# Altium schematic sheet ST_LINK_V2-1.SCHDOC: ST-LINK/V2-1 with support of SWD only
size A4; Date: 29-OCT-2015; Author: A.B; CompanyName: STMicroelectronics; Organization: MCD/TOOLS/GNB; Address1: 12, Rue Jules HOROWITZ; Address2: 38019 Grenoble; Address3: FRANCE; DocumentNumber: MB1225; Revision: B-01; SheetNumber: 3; SheetTotal: 13; Project: STM32F769I-DISCO
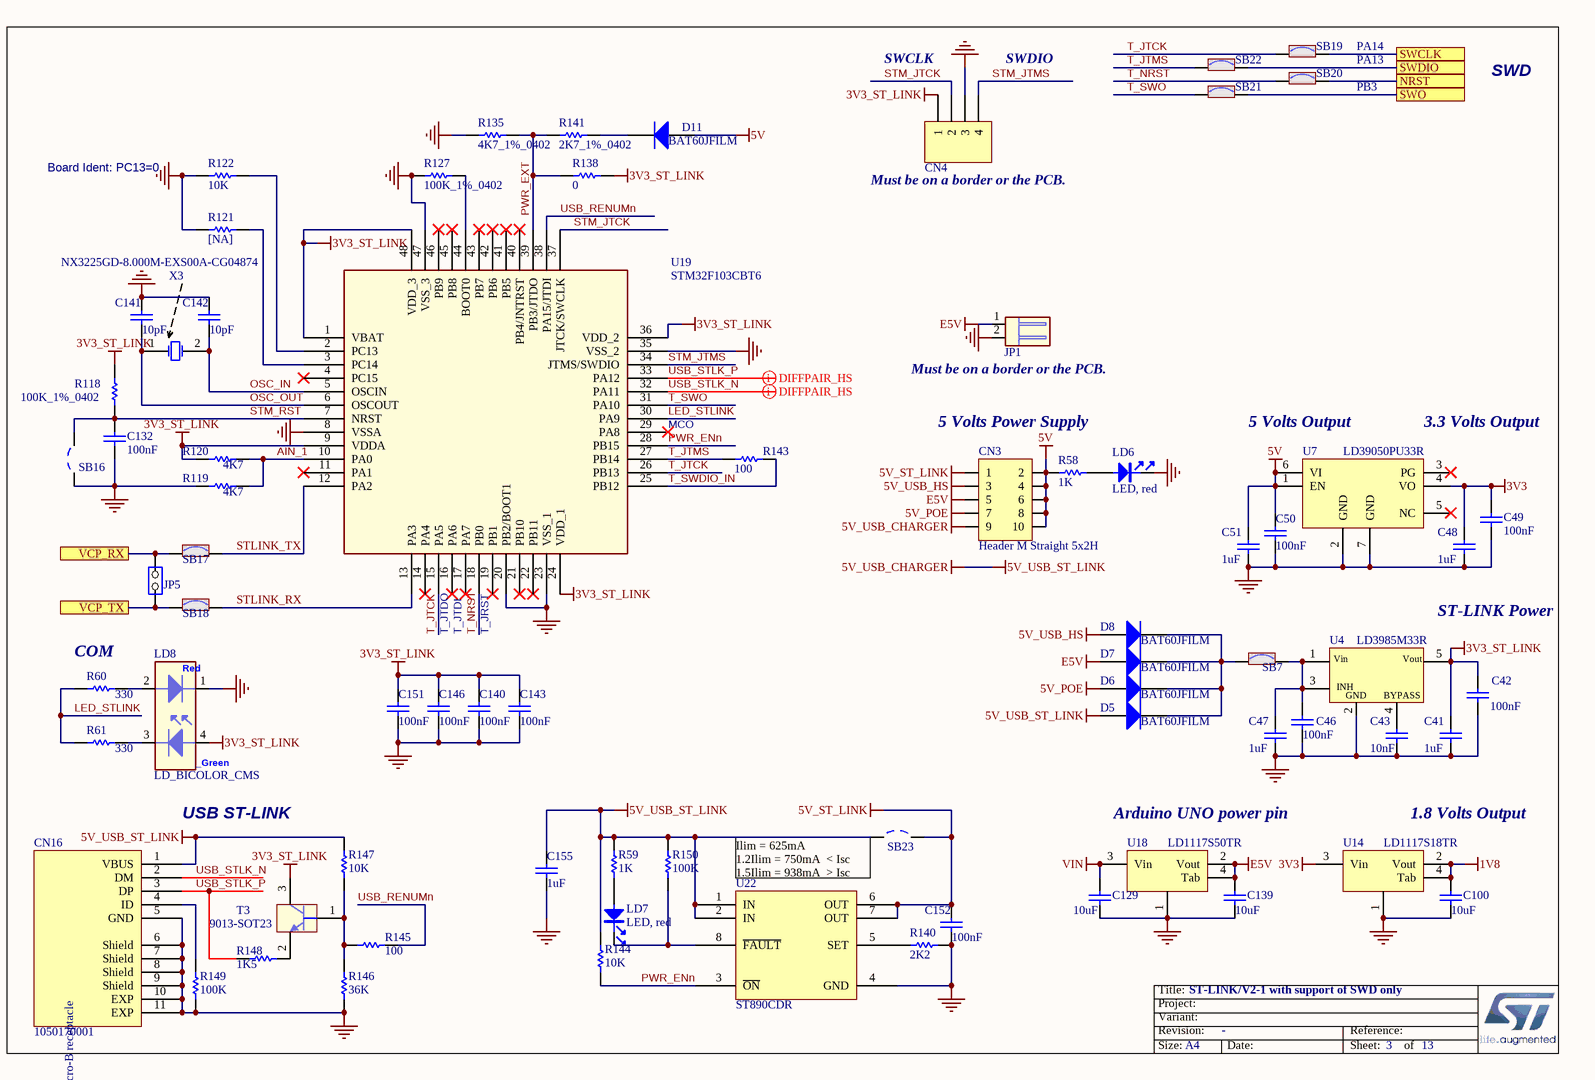
[diagram p0: ST_LINK_V2-1.SCHDOC]

## Parts
C41  1uF  [0603C]
C42  100nF  [0402C]
C43  10nF  [0603C]
C46  100nF  [0402C]
C47  1uF  [0603C]
C48  1uF  [0603C]
C49  100nF  [0402C]
C50  100nF  [0402C]
C51  1uF  [0603C]
C100  10uF  [0603C]
C129  10uF  [0805C]
C132  100nF  [0402C]
C139  10uF  [0805C]
C140  100nF  [0402C]
C141  10pF  [0402C]
C142  10pF  [0402C]
C143  100nF  [0402C]
C146  100nF  [0402C]
C151  100nF  [0402C]
C152  100nF  [0402C]
C155  1uF  [0603C]
CN3  Header M Straight 5x2H  [HDR_2X5_2R54]
CN4  Header 4  [HDR_1X4_2R54]  (value not drawn)
CN16  1050170001  [MICRO_USB_B_105017]
D5  BAT60JFILM  [SOD-323]
D6  BAT60JFILM  [SOD-323]
D7  BAT60JFILM  [SOD-323]
D8  BAT60JFILM  [SOD-323]
D11  BAT60JFILM  [SOD-323]
JP1  WF25402-06421  [HDR_1X2_2R54_RA_11R35]  (value not drawn)
JP5  JP2  [SIP2]  (value not drawn)
LD6  LED, red  [0603D]
LD7  LED, red  [0603D]
LD8  LD_BICOLOR_CMS  [LED2_3528]
R58  1K  [0402R]
R59  1K  [0402R]
R60  330  [0402R]
R61  330  [0402R]
R118  100K_1%_0402  [0402R]
R119  4K7  [0402R]
R120  4K7  [0402R]
R121  [NA]  [0402R]
R122  10K  [0402R]
R127  100K_1%_0402  [0402R]
R135  4K7_1%_0402  [0402R]
R138  0  [0402R]
R140  2K2  [0402R]
R141  2K7_1%_0402  [0402R]
R143  100  [0402R]
R144  10K  [0402R]
R145  100  [0402R]
R146  36K  [0402R]
R147  10K  [0402R]
R148  1K5  [0402R]
R149  100K  [0402R]
R150  100K  [0402R]
SB7  Solder Bridge ON  [JP2_SMD]  (value not drawn)
SB16  Solder Bridge OFF  [JP2_SMD]  (value not drawn)
SB17  Solder Bridge ON  [JP2_SMD]  (value not drawn)
SB18  Solder Bridge ON  [JP2_SMD]  (value not drawn)
SB19  Solder Bridge ON  [JP2_SMD]  (value not drawn)
SB20  Solder Bridge ON  [JP2_SMD]  (value not drawn)
SB21  Solder Bridge ON  [JP2_SMD]  (value not drawn)
SB22  Solder Bridge ON  [JP2_SMD]  (value not drawn)
SB23  Solder Bridge OFF  [JP2_SMD]  (value not drawn)
T3  9013-SOT23  [SOT-23]
U4  LD3985M33R  [SOT-23-5L]
U7  LD39050PU33R  [DFN6_0R95_3X3]
U14  LD1117S18TR  [SOT-223]
U18  LD1117S50TR  [SOT-223]
U19  STM32F103CBT6  [LQFP48_0R5_9X9]
U22  ST890CDR  [SOIC8_1R27_4R9X6]
X3  NX3225GD-8.000M-EXS00A-CG04874  [XTAL_2SM_3R2X2R5_H1]

## Ports
NRST, SWCLK, SWDIO, SWO, VCP_RX, VCP_TX

## Nets
1V8: C100.2 U14.2(Vout) U14.4(Tab)
3V3: C48.2 C49.2 U7.4(VO) U14.3(Vin)
3V3_ST_LINK: C41.1 C42.2 C140.1 C143.2 C146.2 C151.2 CN4.1 LD8.4 R118.2 R120.1 R138.2 T3.3(C) U4.5(Vout) U19.1(VBAT) U19.9(VDDA) U19.24(VDD_1) U19.36(VDD_2) U19.48(VDD_3)
5V: C50.2 C51.2 CN3.2 CN3.4 CN3.6 CN3.8 CN3.10 D11.1(A) R58.1 U7.1(EN) U7.6(VI)
5V_POE: CN3.7 D6.1(A)
5V_ST_LINK: C152.2 CN3.1 SB23.2 U22.6(OUT) U22.7(OUT)
5V_USB_CHARGER: C155.2 CN3.9 CN16.1(VBUS) D5.1(A) R59.2 R144.2 R147.2 R150.2 SB23.1 U22.1(IN) U22.2(IN)  [also labelled 5V_USB_ST_LINK]
5V_USB_HS: CN3.3 D8.1(A)
E5V: C139.2 CN3.5 D7.1(A) JP1.1 U18.2(Vout) U18.4(Tab)
GND: C41.2 C42.1 C43.1 C46.1 C47.1 C48.1 C49.1 C50.1 C51.1 C100.1 C129.1 C132.1 C139.1 C140.2 C141.1 C142.1 C143.1 C146.1 C151.1 C152.1 C155.1 CN4.3 CN16.5(GND) CN16.6(Shield) CN16.7(Shield) CN16.8(Shield) CN16.9(Shield) CN16.10(EXP) CN16.11(EXP) JP1.2 LD6.2 LD8.1 R119.1 R121.1 R122.1 R127.1 R135.1 R140.2 R146.1 R149.1 SB16.1 U4.2(GND) U7.2(GND) U7.7(GND) U14.1 U18.1 U19.8(VSSA) U19.20(PB2/BOOT1) U19.23(VSS_1) U19.35(VSS_2) U19.47(VSS_3) U22.4(GND)
VIN: C129.2 U18.3(Vin)
AIN_1: R119.2 R120.2 U19.10(PA0)
LED_STLINK: R60.1 R61.1 U19.30(PA9)
NRST: SB20.2 ; port NRST
OSC_IN: C142.2 U19.5(OSCIN) X3.2(OSC2)
OSC_OUT: C141.2 U19.6(OSCOUT) X3.1(OSC1)
PWR_ENn: R144.1 U19.28(PB15) U22.3(~{ON})
PWR_EXT: R135.2 R138.1 R141.1 U19.39(PB3/JTDO)
STLINK_RX: SB18.2 U19.13(PA3)
STLINK_TX: SB17.2 U19.12(PA2)
STM_JTCK: CN4.2 U19.37(JTCK/SWCLK)
STM_JTMS: CN4.4 U19.34(JTMS/SWDIO)
STM_RST: C132.2 R118.1 SB16.2 U19.7(NRST)
SWCLK: SB19.2 ; port SWCLK
SWDIO: SB22.2 ; port SWDIO
SWO: SB21.2 ; port SWO
T_JTCK: SB19.1 U19.15(PA5) U19.26(PB13)
T_JTMS: R143.1 SB22.1 U19.27(PB14)
T_NRST: SB20.1 U19.18(PB0)
T_SWDIO_IN: R143.2 U19.25(PB12)
T_SWO: SB21.1 U19.31(PA10)
USB_RENUMn: R145.2 U19.38(PA15/JTDI)
USB_STLK_N: CN16.2(DM) U19.32(PA11)
USB_STLK_P: CN16.3(DP) R148.1 U19.33(PA12)
VCP_RX: JP5.2(NO) SB17.1 ; port VCP_RX
VCP_TX: JP5.1(COMMON) SB18.1 ; port VCP_TX
NetC43_2: C43.2 U4.4(BYPASS)
NetC46_2: C46.2 C47.2 SB7.2 U4.1(Vin) U4.3(CE)
NetCN16_4: CN16.4(ID) R149.2
NetD5_2: D5.2(K) D6.2(K) D7.2(K) D8.2(K) SB7.1
NetD11_2: D11.2(K) R141.2
NetLD6_1: LD6.1 R58.2
NetLD7_1: LD7.1 R59.1
NetLD7_2: LD7.2 R150.1 U22.8(~{FAULT})
NetLD8_2: LD8.2 R60.2
NetLD8_3: LD8.3 R61.2
NetR121_2: R121.2 U19.3(PC14)
NetR122_2: R122.2 U19.2(PC13)
NetR127_2: R127.2 U19.44(BOOT0)
NetR140_1: R140.1 U22.5(SET)
NetR145_1: R145.1 R146.2 R147.1 T3.1(B)
NetR148_2: R148.2 T3.2(E)

Not connected (* = marked no-connect by the designer): U7 3(PG)* 5(NC)*; U19 4(PC15)* 11(PA1)* 14(PA4)* 16(PA6)* 17(PA7)* 19(PB1)* 21(PB10)* 22(PB11)* 29(PA8)* 40(PB4/JNTRST)* 41(PB5)* 42(PB6)* 43(PB7)* 45(PB8)* 46(PB9)*

## Layout directives
differential pair: USB_STLK_N, USB_STLK_P

## Notes on the sheet
- SWCLK
- SWDIO
- PA14
- PA13
- PB3
- SWD
- Board Ident: PC13=0
- (near CN4) Must be on a border or the PCB.
- (near JP1) Must be on a border or the PCB.
- MCO
- 5 Volts Power Supply
- (near U7) 5 Volts Output
- (near U7) 3.3 Volts Output
- (near R60) COM
- T_JTDO
- T_JTDI
- T_JRST
- ST-LINK Power
- USB ST-LINK
- (near SB23) Ilim = 625mA
  1.2Ilim = 750mA  < Isc
  1.5Ilim = 938mA  > Isc
- Arduino UNO power pin
- 1.8 Volts Output
- Title:
- Project:
- Size:
- Revision:
- Variant:
- A4
- -
- Date:
- Reference:
- Sheet:
- of
- (in symbol 1050170001) USB_Micro-B receptacle
- (in symbol LD3985M33R) INH
- (in symbol LD_BICOLOR_CMS) Red; _Green

## Library data of the parts
C41 C47 C48 C51 C155 = Cap_1uF_X5R_10%_0603: Capacitor,1uF,16V,X5R,10%,0603,YAGEO; Manuf_Part_1: CC0603KRX5R7BB105; Revision: July-2002: Re-released for DXP Platform.; Value: 1uF; Order: CC0603KRX5R7BB105; Manuf_1: YAGEO
  C155: ECCN_US/EU: n/a
C42 C46 C49 C50 C132 C140 C143 C146 C151 C152 = Cap_100nF_X7R_10%_0402: Capacitor,100nF,16V,X7R,10%,0402,YAGEO; Manuf_Part_1: CC0402KRX7R7BB104; Revision: July-2002: Re-released for DXP Platform.; Value: 100nF; Order: CC0402KRX7R7BB104; Manuf_1: YAGEO
C43 = Cap_10nF_X7R_10%_0603: Capacitor,10nF,50V,X7R,10%,0603,YAGEO; Manuf_Part_1: CC0603KRX7R9BB103; Revision: July-2002: Re-released for DXP Platform.; Value: 10nF; Order: CC0603KRX7R9BB103; Manuf_1: YAGEO
C100 = Cap_10uF_X5R_10%_0603: Capacitor,10uF,6.3V,X5R,10%,0603,YAGEO; Manuf_Part_1: CC0603KRX5R5BB106; Revision: July-2002: Re-released for DXP Platform.; Value: 10uF; Order: CC0603KRX5R5BB106; Manuf_1: YAGEO; ECCN_US/EU: n/a
C129 C139 = Cap_10uF_X5R_10%_0805: Capacitor,10uF,25V,X5R,10%,0805,YAGEO; Manuf_Part_1: CC0805KRX5R8BB106; Revision: July-2002: Re-released for DXP Platform.; Value: 10uF; Order: CC0805KRX5R8BB106; Manuf_1: YAGEO; ECCN_US/EU: n/a
C141 C142 = Cap_10pF_NPO_5%_0402: Capacitor,10pF,50V,NPO,5%,0402,YAGEO; Order: CC0402JRNPO9BN100; Revision: July-2002: Re-released for DXP Platform.; Value: 10pF; Manuf_1: YAGEO; Manuf_Part_1: CC0402JRNPO9BN100; ECCN_US/EU: n/a
CN3 = Header 5X2M: Header Male, 5-Pin, Dual row, Straight, AMD; Manuf_Part_1: 826632-5; Manuf_1: AMD; Distrib: Sub Co; Footprint: HDR2X5H; ECCN_US/EU: n/a; SOFER_FP: HDR_2X5_2R54
CN4 = Header 4: Header, 4-Pin; Fitted: NO; Revision: 17-Jul-2002: Re-released for DXP Platform.; Publisher: Altium Limited; ECCN_US/EU: n/a; SOFER_FP: HDR_1X4_2R54
CN16 = 1050170001: USB-MICRO-B, 1050170001, SMT, MOLEX; ECCN_US/EU: n/a; Manuf_1: MOLEX; Manuf_Part_1: 1050170001; Distrib: DIGIKEY; SOFER_FP: MICRO_USB_B_105017
D5-D8 D11 = BAT60JFILM: Manuf_1: STM; Provided: ST; ECCN_US/EU: EAR99/NEC; Ref St: 9151097; Revision: July-2002: Re-released for DXP Platform.; Order: BAT60JFILM; Manuf_Part_1: BAT60JFILM; Distrib: ST
JP1 = JP2_RA: Header, 2-Pins, Single row, Right Angle, 2.54 mm pitch, DIP; Manuf_1: ATOM; ECCN_US/EU: n/a; Manuf_Part_1: WF25402-06421; Distrib: Sub Co
JP5 = JP2: Fitted: NO; ECCN_US/EU: n/a
LD6 LD7 = LED_red: LED, red, 0603; Manuf_1: everlight; Manuf_Part_1: 19-213-R6C-AP1Q2B/3T; ECCN_US/EU: EAR99/NEC; Order: 19-213-R6C-AP1Q2B/3T
LD8 = LD_BICOLOR_CMS: Bicolor Led; Manuf_Part_1: HSMF-A201-A00J1; Manuf_1: Avago Technologies; Manuf_2: everluck; Manuf_Part_2: LE-RGW35280; Ref St: xxxxxx; ECCN_US/EU: EAR99/NEC; Distrib: RADIOSPARES; Footprint: HSMF-A201
R58 R59 = Res_1K_1%_0402: Resistor,1K,0402,1%,YAGEO; Manuf_Part_1: RC0402FR-071KL; Value: 1K; Manuf_1: YAGEO; Order: RC0402FR-071KL; ECCN_US/EU: n/a
R60 R61 = Res_330_1%_0402: Resistor,330,0402,1%,YAGEO; Manuf_Part_1: RC0402FR-07330RL; Value: 330; ECCN_US/EU: n/a; Manuf_1: YAGEO; Distrib: DIGIKEY; Order: RC0402FR-07330RL
R118 R127 R149 R150 = Res_100K_1%_0402: Resistor,100K,0402,1%,YAGEO; Manuf_Part_1: RC0402FR-07100KL; Manuf_Part_2: RT0402FRE07100KL; Value: 100K; Manuf_1: YAGEO; ECCN_US/EU: n/a; Manuf_2: YAGEO
R119 R120 R135 = Res_4K7_1%_0402: Resistor,4K7,0402,1%,YAGEO; Manuf_Part_1: RC0402FR-074K7L; Manuf_Part_2: RT0402FRE074K7L; Value: 4K7; Manuf_1: YAGEO; ECCN_US/EU: n/a; Manuf_2: YAGEO
R121 = Res_NA_0402: Resistor,[NA],0402; Fitted: NO; Value: [NA]; ECCN_US/EU: n/a
R122 R144 R147 = Res_10K_1%_0402: Resistor,10K,0402,1%,YAGEO; Manuf_Part_1: RC0402FR-0710KL; Value: 10K; Manuf_1: YAGEO; Order: RC0402FR-0710KL; ECCN_US/EU: n/a
R138 = Res_0_5%_0402: Resistor,0,0402,5%,YAGEO; Manuf_Part_1: RC0402JR-070RL; Order: 2363467; Fitted: NO; Value: 0; ECCN_US/EU: n/a; Manuf_1: YAGEO; Distrib: FARNELL
R140 = Res_2K2_1%_0402: Resistor,2K2,0402,1%,YAGEO; Manuf_Part_1: RC0402FR-072K2L; Value: 2K2; Manuf_1: YAGEO; Order: RC0402FR-072K2L; ECCN_US/EU: n/a
R141 = Res_2K7_1%_0402: Resistor,2K7,0402,1%,YAGEO; Manuf_Part_1: RC0402FR-072K7L; Value: 2K7; Manuf_1: YAGEO; Order: RC0402FR-072K7L; ECCN_US/EU: n/a; Distrib: FARNELL
R143 R145 = Res_100_1%_0402: Resistor,100,0402,1%,YAGEO; Manuf_Part_1: RC0402FR-07100RL; Order: 9239111; Value: 100; Manuf_1: YAGEO; ECCN_US/EU: n/a; Distrib: FARNELL
R146 = Res_36K_1%_0402: Resistor,36K,0402,1%,YAGEO; Manuf_Part_1: RC0402FR-0736KL; Value: 36K; Manuf_1: YAGEO; Order: RC0402FR-0736KL; ECCN_US/EU: n/a; Distrib: FARNELL
R148 = Res_1K5_1%_0402: Resistor,1K5,0402,1%,YAGEO; Manuf_Part_1: RC0402FR-071K5L; Value: 1K5; Manuf_1: YAGEO; Order: RC0402FR-071K5L; ECCN_US/EU: n/a; Distrib: FARNELL
SB7 SB17-SB22 = SB_ON: Solder: YES; Revision: July-2002: Re-released for DXP Platform.; ECCN_US/EU: n/a
SB16 SB23 = SB_OFF: Solder: NO; Revision: July-2002: Re-released for DXP Platform.; ECCN_US/EU: n/a
T3 = 9013-SOT23: NPN Bipolar Transistor; Manuf_1: NXP; Manuf_Part_1: BSR14; Order: 1081310; ECCN_US/EU: EAR99/NEC; Revision: July-2002: Re-released for DXP Platform.; Distrib: FARNELL
U4 = LD3985M33R: Ultra low drop-low noise BiCMOS voltage, regulators low ESR capacitors compatible; Manuf_1: STM; Provided: ST; Ref St: 9176161; ECCN_US/EU: EAR99/NEC; Manuf_Part_1: LD3985M33R; Distrib: ST; Order: LD3985M33R
U7 = LD39050P: Ultra low drop-low , 500 mA low quiescent current; Manuf_1: STM; Provided: ST; ECCN_US/EU: EAR99/NEC; Ref St: xxxxxxxx; Distrib: ST; Manuf_Part_1: LD39050PU33R; Order: LD39050PU33R
U14 = LD1117S18TR: LOW DROP FIXED AND ADJUSTABLE POSITIVE VOLTAGE REGULATORS (1.8 Volts); Manuf_1: STM; Ref St: 9176180; ECCN_US/EU: EAR99/NEC; Provided: ST; Manuf_Part_1: LD1117S18TR; Order: LD1117S18TR; Distrib: ST
U18 = LD1117S50TR: IC REG LDO 5V 0.8A SOT223; Manuf_1: STM; Ordered by: ST; ECCN_US/EU: EAR99/NEC; Ref St: 9176133; Manuf_Part_1: LD1117S50TR; Distrib: ST; Order: LD1117S50TR; Provided: ST
U19 = STM32F103CBT6: Medium-density performance line ARM-based 32-bit MCU with 128KB Flash; Manuf_1: STM; Ref St: xxxxxxxx; Provided: ST; ECCN_US/EU: 3A991A2/NEC; Footprint: QFP48 7X7; Manuf_Part_1: STM32F103CBT6; Order: STM32F103CBT6; Distrib: ST
U22 = ST890CDR: 1.2 A current limited high-side power switch with thermal shutdown; Manuf_1: STM; ECCN_US/EU: EAR99/NEC; Provided: ST; Manuf_Part_1: ST890CDR; Distrib: ST; Footprint: SO-8
X3 = XTAL_8M_NX3225GD: Crystal 8Mhz, 8pF, -+50PPM, SMD; Manuf_1: NDK; Manuf_Part_1: NX3225GD 8MHz EXS00A-CG04874; Manuf_Part_2: NX3225GD-8.000M-STD-CRA-3; ECCN_US/EU: EAR99/NEC; NDK Ref: X3127326; Ref St: 9157029; Provided: ST; Order: NX3225GD 8MHz EXS00A-CG04874